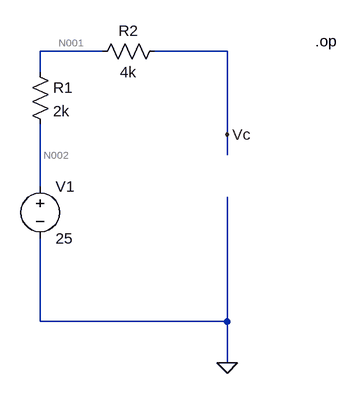
[diagram p0: schematic ouvert.asc]
ouvert.asc, the LTspice schematic file:
Version 4
SHEET 1 884 680
WIRE 96 64 0 64
WIRE 288 64 176 64
WIRE 0 96 0 64
WIRE 288 192 288 64
WIRE 288 224 288 192
WIRE 0 272 0 176
WIRE 0 480 0 352
WIRE 288 480 288 288
WIRE 288 480 0 480
WIRE 288 544 288 480
FLAG 288 192 Vc
FLAG 288 544 0
SYMBOL voltage 0 256 R0
SYMATTR InstName V1
SYMATTR Value 25
SYMBOL res -16 80 R0
SYMATTR InstName R1
SYMATTR Value 2k
SYMBOL res 192 48 R90
WINDOW 0 0 56 VBottom 2
WINDOW 3 32 56 VTop 2
SYMATTR InstName R2
SYMATTR Value 4k
TEXT 424 48 Left 2 !.op

The netlist it stands for:
* ouvert.asc
V1 N002 0 25
R1 N001 N002 2k
R2 Vc N001 4k
.op
.backanno
.end

* Results of the author's LTspice run, read from the files saved beside the schematic
* Operating Point:
*   V(n002) = 25 V
*   V(n001) = 25 V
*   V(vc) = 25 V
*   I(R2) = 0 A
*   I(R1) = 0 A
*   I(V1) = 0 A